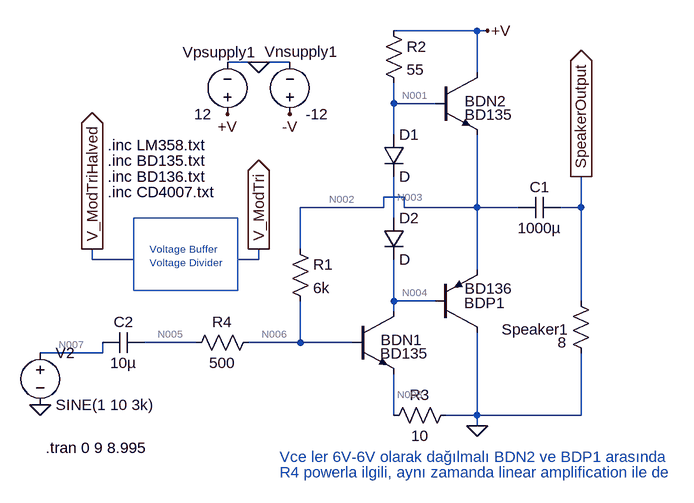
[diagram p0: schematic PowerAmp_only.asc]
PowerAmp_only.asc, the LTspice schematic file:
Version 4
SHEET 1 1104 680
WIRE 768 -224 640 -224
WIRE 784 -224 768 -224
WIRE 432 -176 384 -176
WIRE 480 -176 432 -176
WIRE 768 -160 768 -224
WIRE 640 -112 640 -144
WIRE 704 -112 640 -112
WIRE 640 -64 640 -112
WIRE 656 32 624 32
WIRE 624 48 624 32
WIRE 624 48 496 48
WIRE 656 48 656 32
WIRE 768 48 768 -64
WIRE 768 48 656 48
WIRE 832 48 768 48
WIRE 928 48 928 0
WIRE 928 48 896 48
WIRE 640 64 640 0
WIRE 496 112 496 48
WIRE 176 128 176 112
WIRE 240 128 176 128
WIRE 432 128 432 112
WIRE 432 128 400 128
WIRE 768 144 768 48
WIRE 640 192 640 128
WIRE 704 192 640 192
WIRE 928 192 928 48
WIRE 640 208 640 192
WIRE 336 256 256 256
WIRE 496 256 496 192
WIRE 496 256 416 256
WIRE 576 256 496 256
WIRE 192 272 192 256
WIRE 192 272 96 272
WIRE 640 368 640 304
WIRE 768 368 768 240
WIRE 768 368 720 368
WIRE 928 368 928 272
WIRE 928 368 768 368
WIRE 768 384 768 368
FLAG 784 -224 +V
FLAG 928 0 SpeakerOutput
IOPIN 928 0 Out
FLAG 768 384 0
FLAG 432 -176 0
FLAG 384 -96 +V
FLAG 480 -96 -V
FLAG 176 112 V_ModTriHalved
IOPIN 176 112 Out
FLAG 432 112 V_ModTri
IOPIN 432 112 Out
FLAG 96 352 0
SYMBOL npn3 576 208 R0
WINDOW 0 44 44 Left 2
WINDOW 3 43 65 Left 2
SYMATTR InstName BDN1
SYMATTR Value BD135
SYMBOL res 480 96 R0
SYMATTR InstName R1
SYMATTR Value 6k
SYMBOL res 624 -240 R0
SYMATTR InstName R2
SYMATTR Value 55
SYMBOL res 912 176 R0
WINDOW 0 -106 60 Left 2
WINDOW 3 -20 80 Left 2
SYMATTR InstName Speaker1
SYMATTR Value 8
SYMBOL cap 256 240 R90
WINDOW 0 0 32 VBottom 2
WINDOW 3 32 32 VTop 2
SYMATTR InstName C2
SYMATTR Value 10µ
SYMBOL res 736 352 R90
WINDOW 0 0 56 VBottom 2
WINDOW 3 32 56 VTop 2
SYMATTR InstName R3
SYMATTR Value 10
SYMBOL res 432 240 R90
WINDOW 0 0 56 VBottom 2
WINDOW 3 32 56 VTop 2
SYMATTR InstName R4
SYMATTR Value 500
SYMBOL pnp 704 240 M180
WINDOW 0 44 45 Left 2
WINDOW 3 45 67 Left 2
SYMATTR InstName BDP1
SYMATTR Value BD136
SYMBOL npn3 704 -160 R0
WINDOW 0 45 44 Left 2
WINDOW 3 45 65 Left 2
SYMATTR InstName BDN2
SYMATTR Value BD135
SYMBOL diode 624 -64 R0
SYMATTR InstName D1
SYMBOL diode 624 64 R0
SYMATTR InstName D2
SYMBOL cap 896 32 R90
WINDOW 0 0 32 VBottom 2
WINDOW 3 32 32 VTop 2
SYMATTR InstName C1
SYMATTR Value 1000µ
SYMBOL voltage 480 -80 M180
WINDOW 0 -39 112 Left 2
WINDOW 3 24 16 Left 2
WINDOW 123 0 0 Left 2
WINDOW 39 0 0 Left 2
SYMATTR InstName Vnsupply1
SYMATTR Value -12
SYMBOL voltage 384 -80 R180
WINDOW 0 -44 111 Left 2
WINDOW 3 24 16 Left 2
WINDOW 123 0 0 Left 2
WINDOW 39 0 0 Left 2
SYMATTR InstName Vpsupply1
SYMATTR Value 12
SYMBOL voltage 96 256 R0
WINDOW 123 0 0 Left 2
WINDOW 39 0 0 Left 2
SYMATTR InstName V2
SYMATTR Value SINE(1 10 3k)
TEXT 200 -48 Left 2 !.inc LM358.txt
TEXT 200 -24 Left 2 !.inc BD135.txt
TEXT 200 0 Left 2 !.inc BD136.txt
TEXT 200 24 Left 2 !.inc CD4007.txt
TEXT 264 112 Left 1 ;Voltage Buffer\nVoltage Divider
TEXT 104 418 Left 2 !.tran 0 9 8.995
TEXT 464 432 Left 2 ;Vce ler 6V-6V olarak dağılmalı BDN2 ve BDP1 arasında
TEXT 464 456 Left 2 ;R4 powerla ilgili, aynı zamanda linear amplification ile de
RECTANGLE Normal 400 176 240 64

The netlist it stands for:
* PowerAmp_only.asc
Q§BDN1 N004 N006 N008 0 BD135
R1 N002 N006 6k
R2 +V N001 55
R§Speaker1 SpeakerOutput 0 8
C2 N005 N007 10µ
R3 0 N008 10
R4 N006 N005 500
Q§BDP1 0 N004 N002 0 BD136
Q§BDN2 +V N001 N002 0 BD135
D1 N001 N003 D
D2 N003 N004 D
C1 SpeakerOutput N002 1000µ
Vnsupply1 -V 0 -12
Vpsupply1 +V 0 12
V2 N007 0 SINE(1 10 3k)
.model D D
.lib standard.dio
.model NPN NPN
.model PNP PNP
.lib standard.bjt
.inc LM358.txt
.inc BD135.txt
.inc BD136.txt
.inc CD4007.txt
* Voltage Buffer
* Voltage Divider
.tran 0 9 8.995
* Vce ler 6V-6V olarak dağılmalı BDN2 ve BDP1 arasında
* R4 powerla ilgili, aynı zamanda linear amplification ile de
.backanno
.end

* Results of the author's LTspice run, read from the files saved beside the schematic
* Operating Point, zero values left out:
*   V(n004) = 5.24 V
*   V(n006) = 1.3 V
*   V(n008) = 870.9 mV
*   V(n002) = 5.967 V
*   V(+v) = 12 V
*   V(n001) = 6.777 V
*   V(n005) = 1.3 V
*   V(n007) = 1 V
*   V(n003) = 6.009 V
*   V(-v) = -12 V
*   Ic(Bdp1) = -722.7 mA
*   Ib(Bdp1) = -6.816 mA
*   Ie(Bdp1) = 729.5 mA
*   Ic(Bdn2) = 714.8 mA
*   Ib(Bdn2) = 15.46 mA
*   Ie(Bdn2) = -730.3 mA
*   Ic(Bdn1) = 86.32 mA
*   Ib(Bdn1) = 778 µA
*   Ie(Bdn1) = -87.09 mA
*   I(D2) = 79.5 mA
*   I(D1) = 79.5 mA
*   I(R3) = -87.09 mA
*   I(R2) = 94.96 mA
*   I(R1) = 778 µA
*   I(Vpsupply1) = -809.8 mA
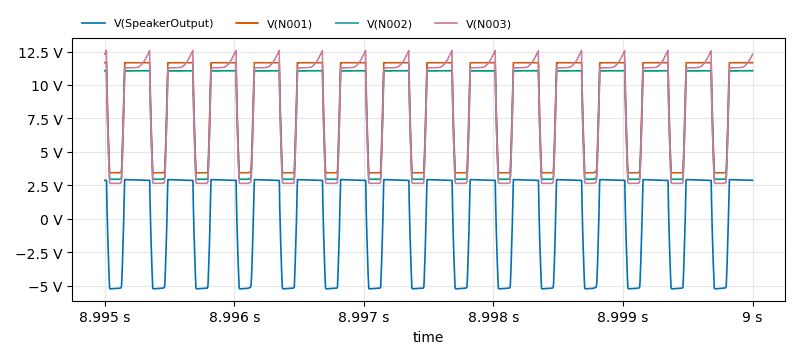
[diagram p1: Transient Analysis of PowerAmp_only.asc, plotted from the saved traces]
* Transient Analysis, 1 run:
*   V(SpeakerOutput): min -5.23 V, max 2.929 V, average 5.141 mV, rms 3.68 V, last 2.877 V
*   V(N001): min 3.435 V, max 11.67 V, average 8.751 V, rms 9.513 V, last 11.67 V
*   V(N002): min 2.95 V, max 11.07 V, average 8.165 V, rms 8.956 V, last 11.07 V
*   V(N003): min 2.649 V, max 12.59 V, average 8.353 V, rms 9.28 V, last 12.3 V